# Altium schematic sheet 0072_HSIO MUXING -3.SchDoc
size 848 x 558 mm
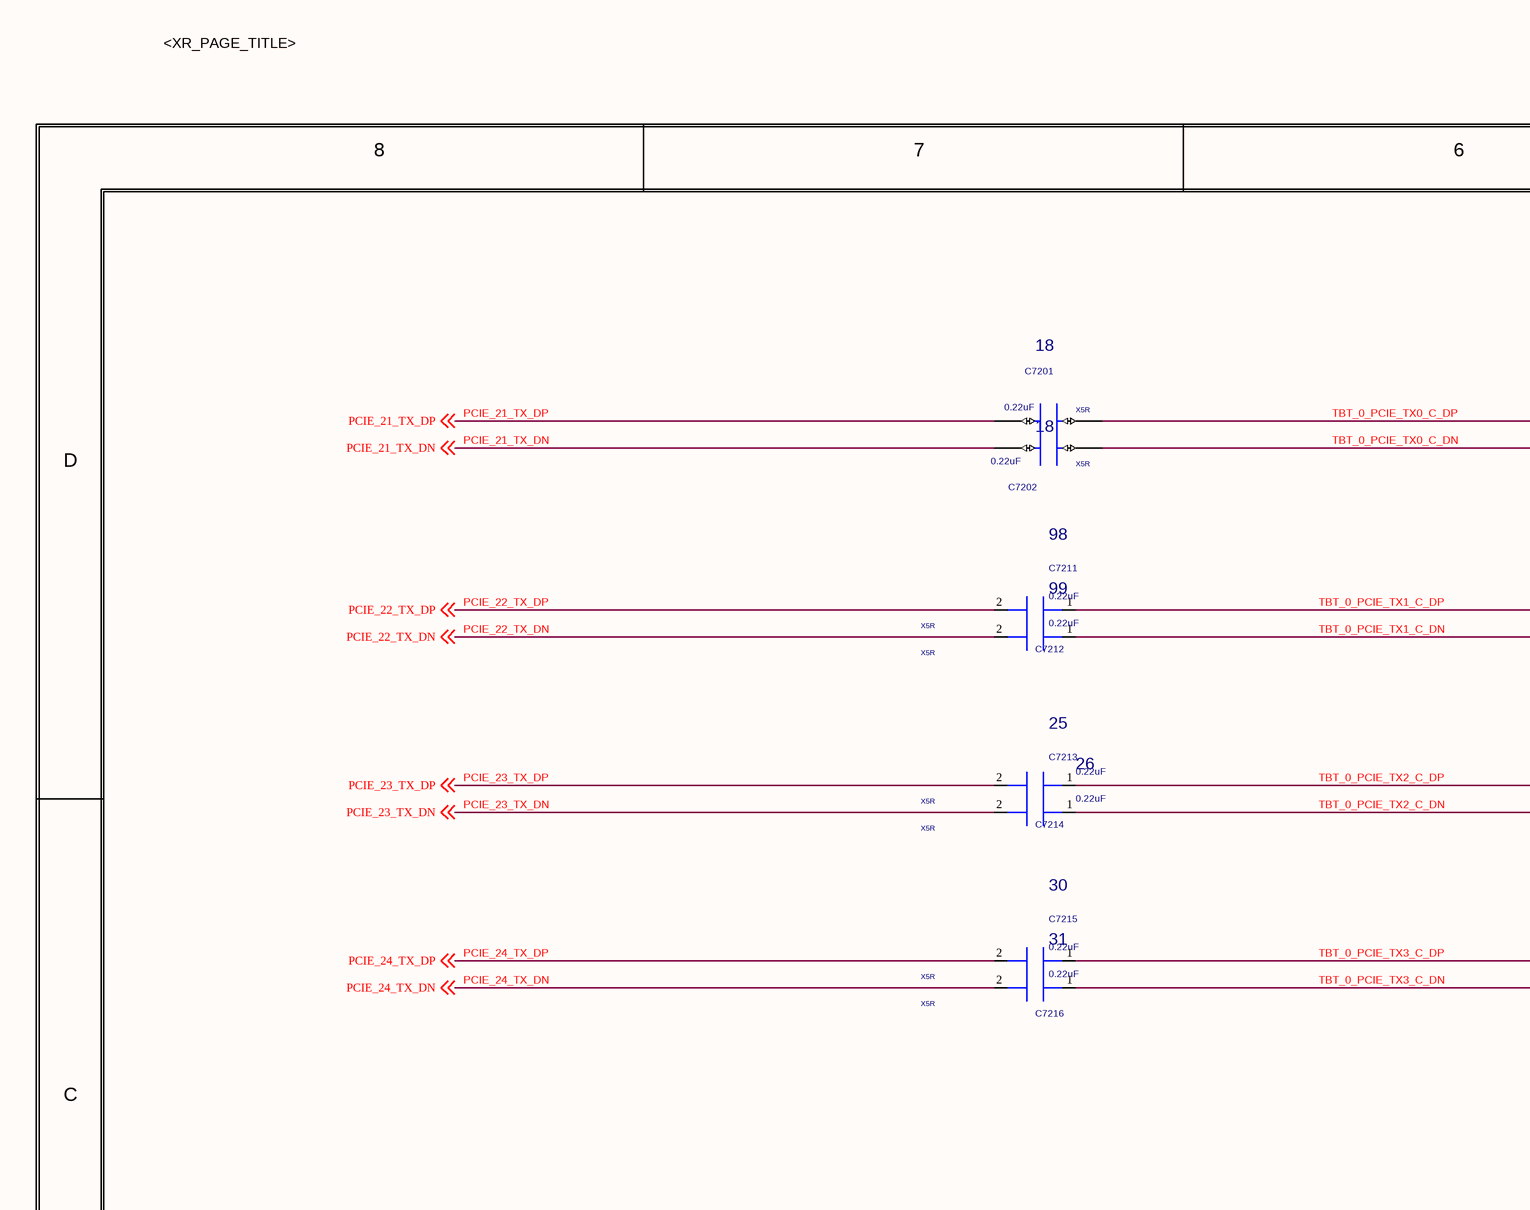
[diagram p0: 0072_HSIO MUXING -3.SchDoc, top left]
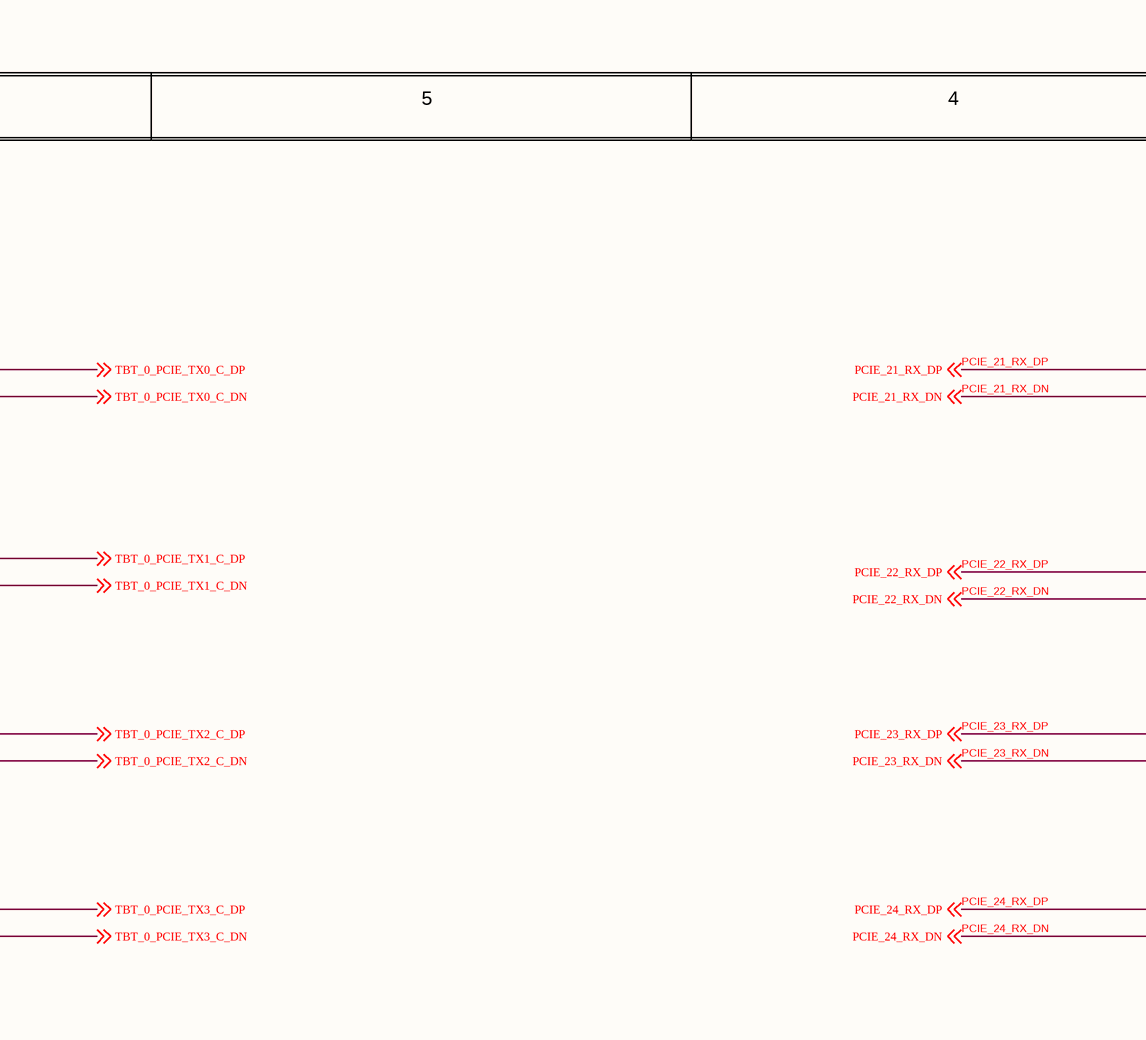
[diagram p1: 0072_HSIO MUXING -3.SchDoc, top middle]
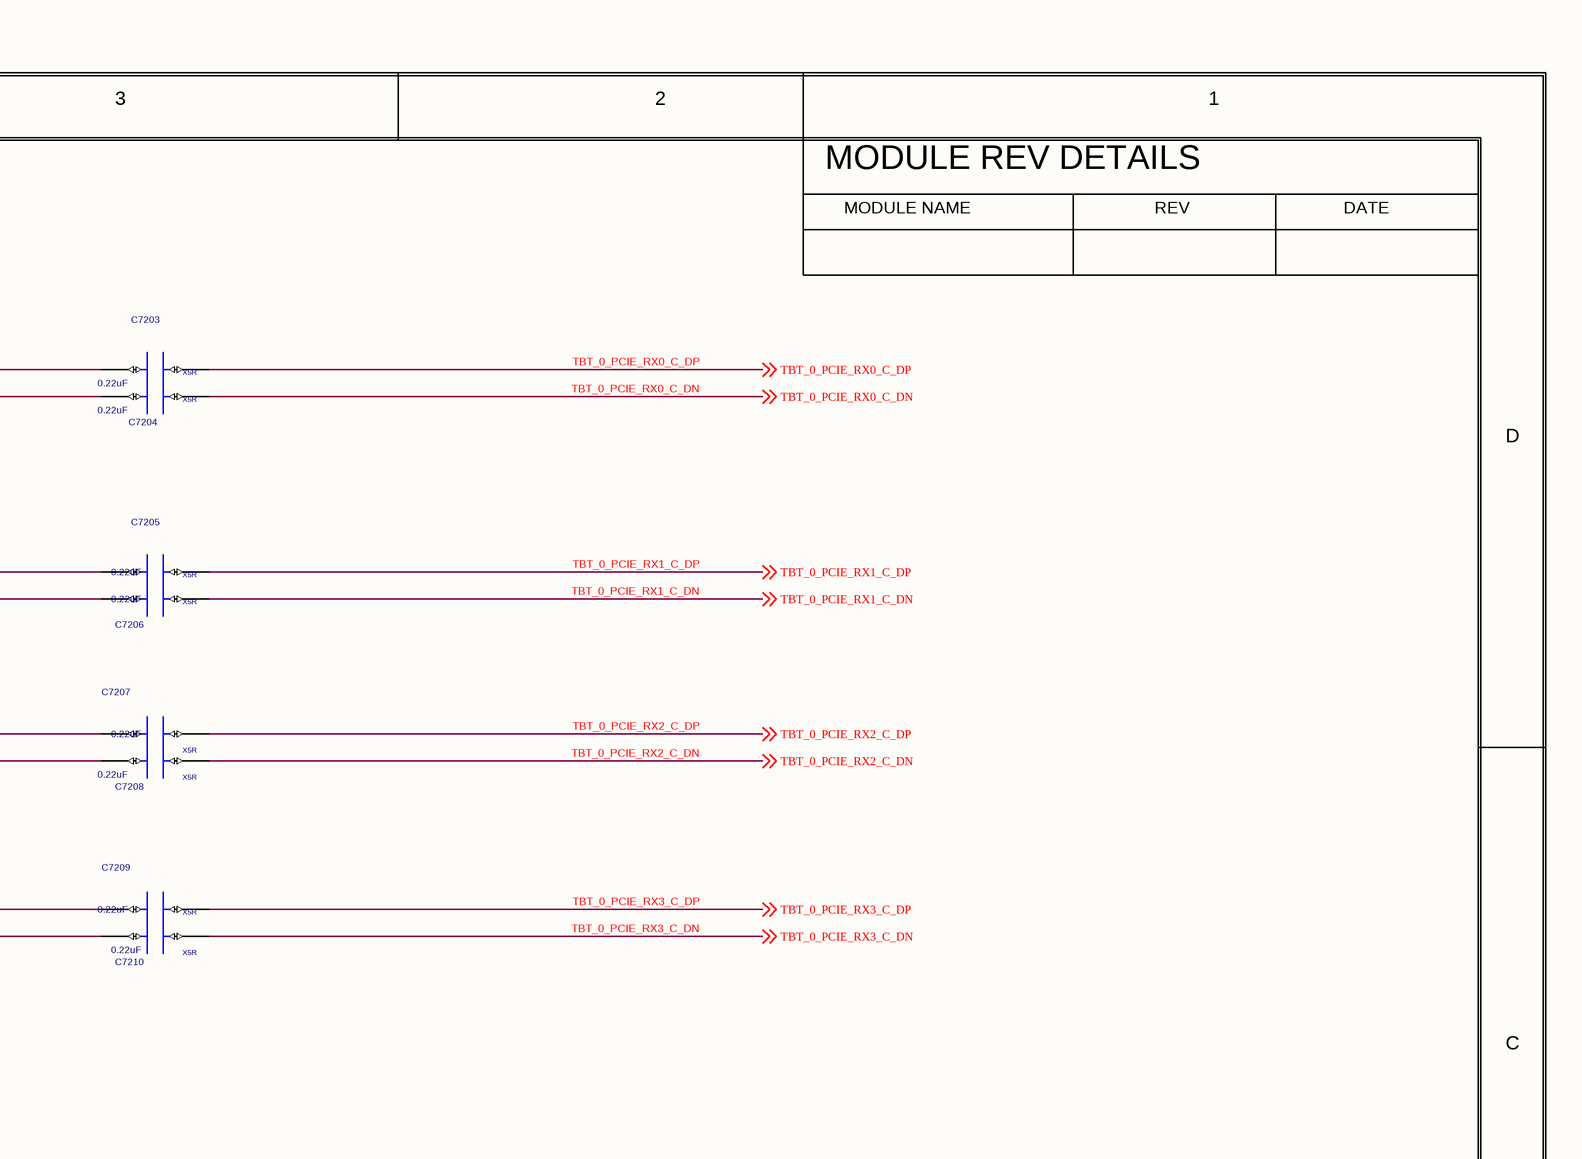
[diagram p2: 0072_HSIO MUXING -3.SchDoc, top right]
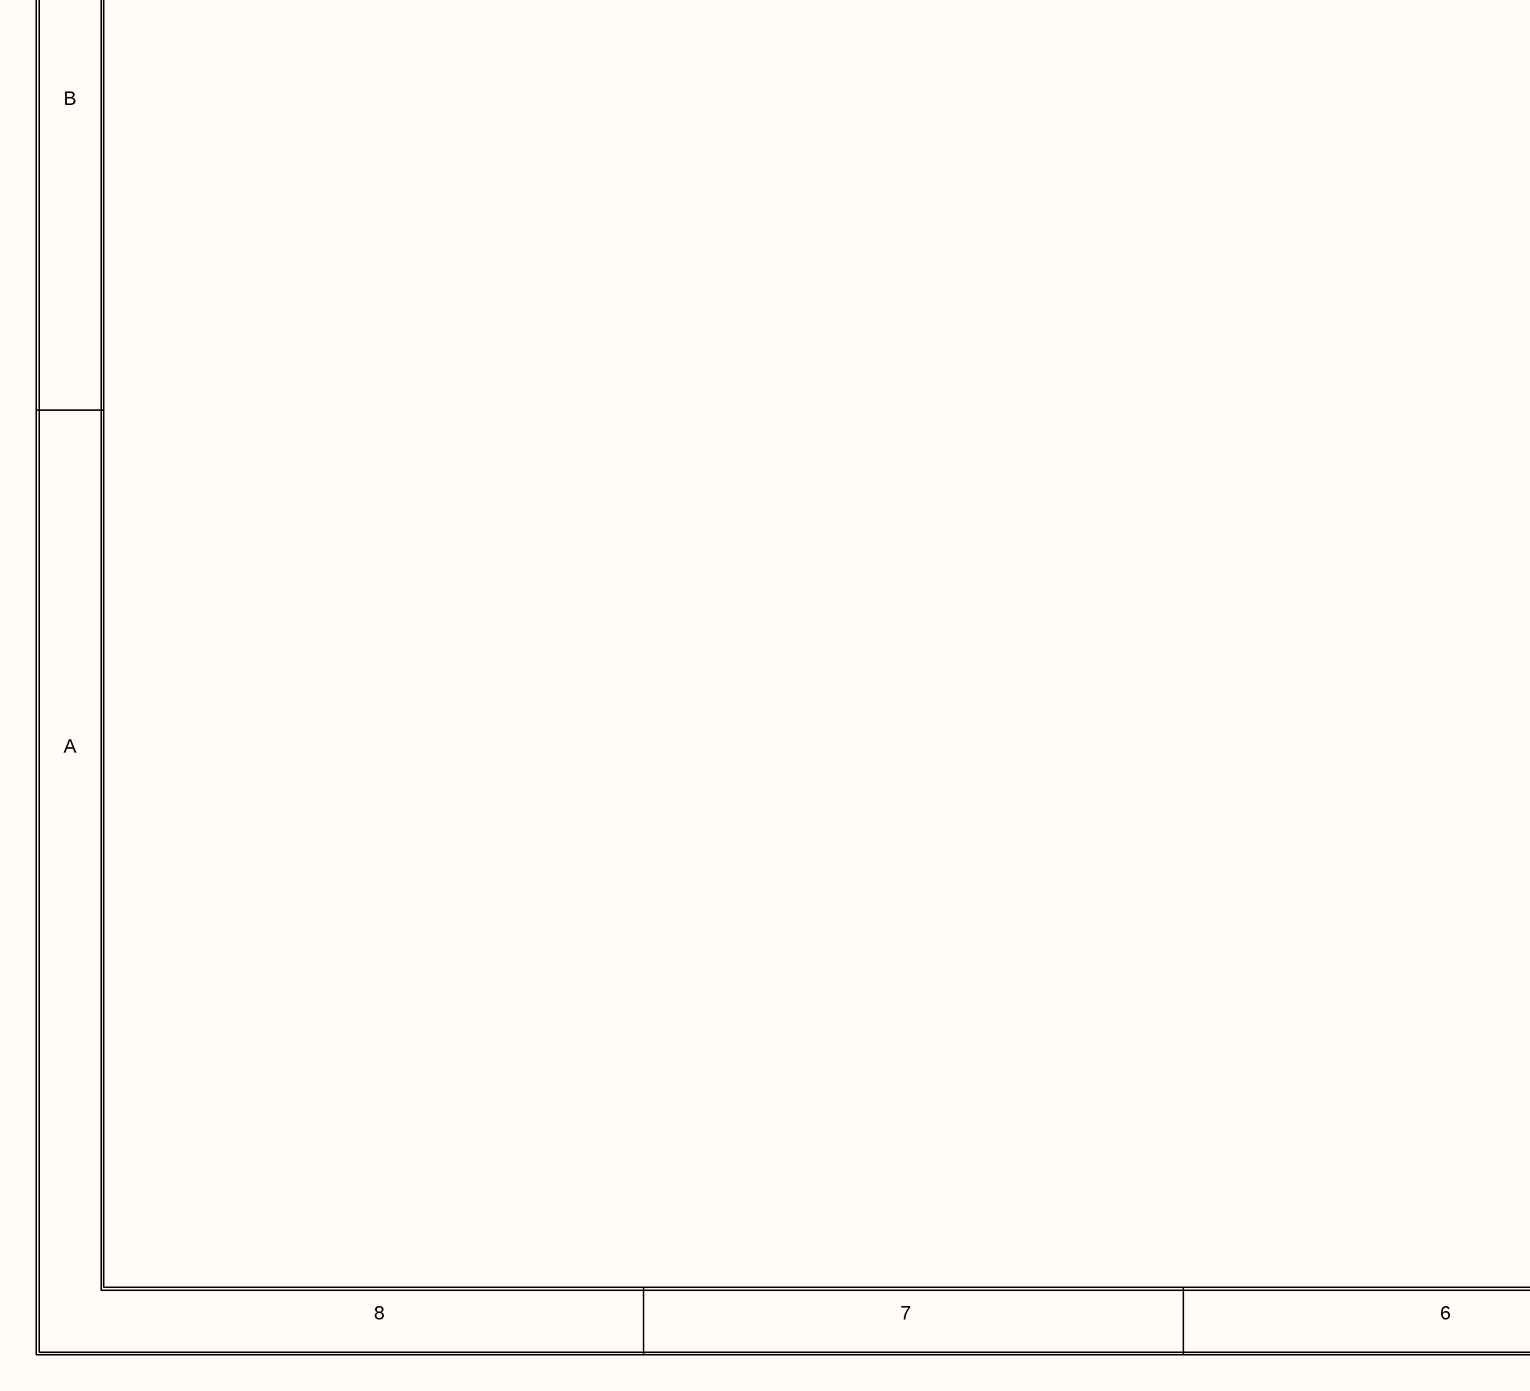
[diagram p3: 0072_HSIO MUXING -3.SchDoc, bottom left]
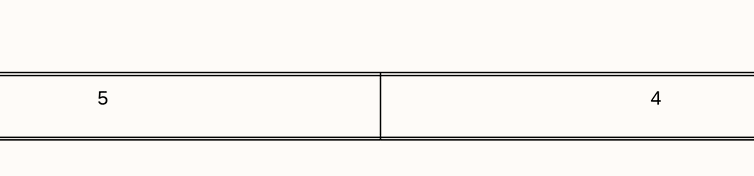
[diagram p4: 0072_HSIO MUXING -3.SchDoc, bottom middle]
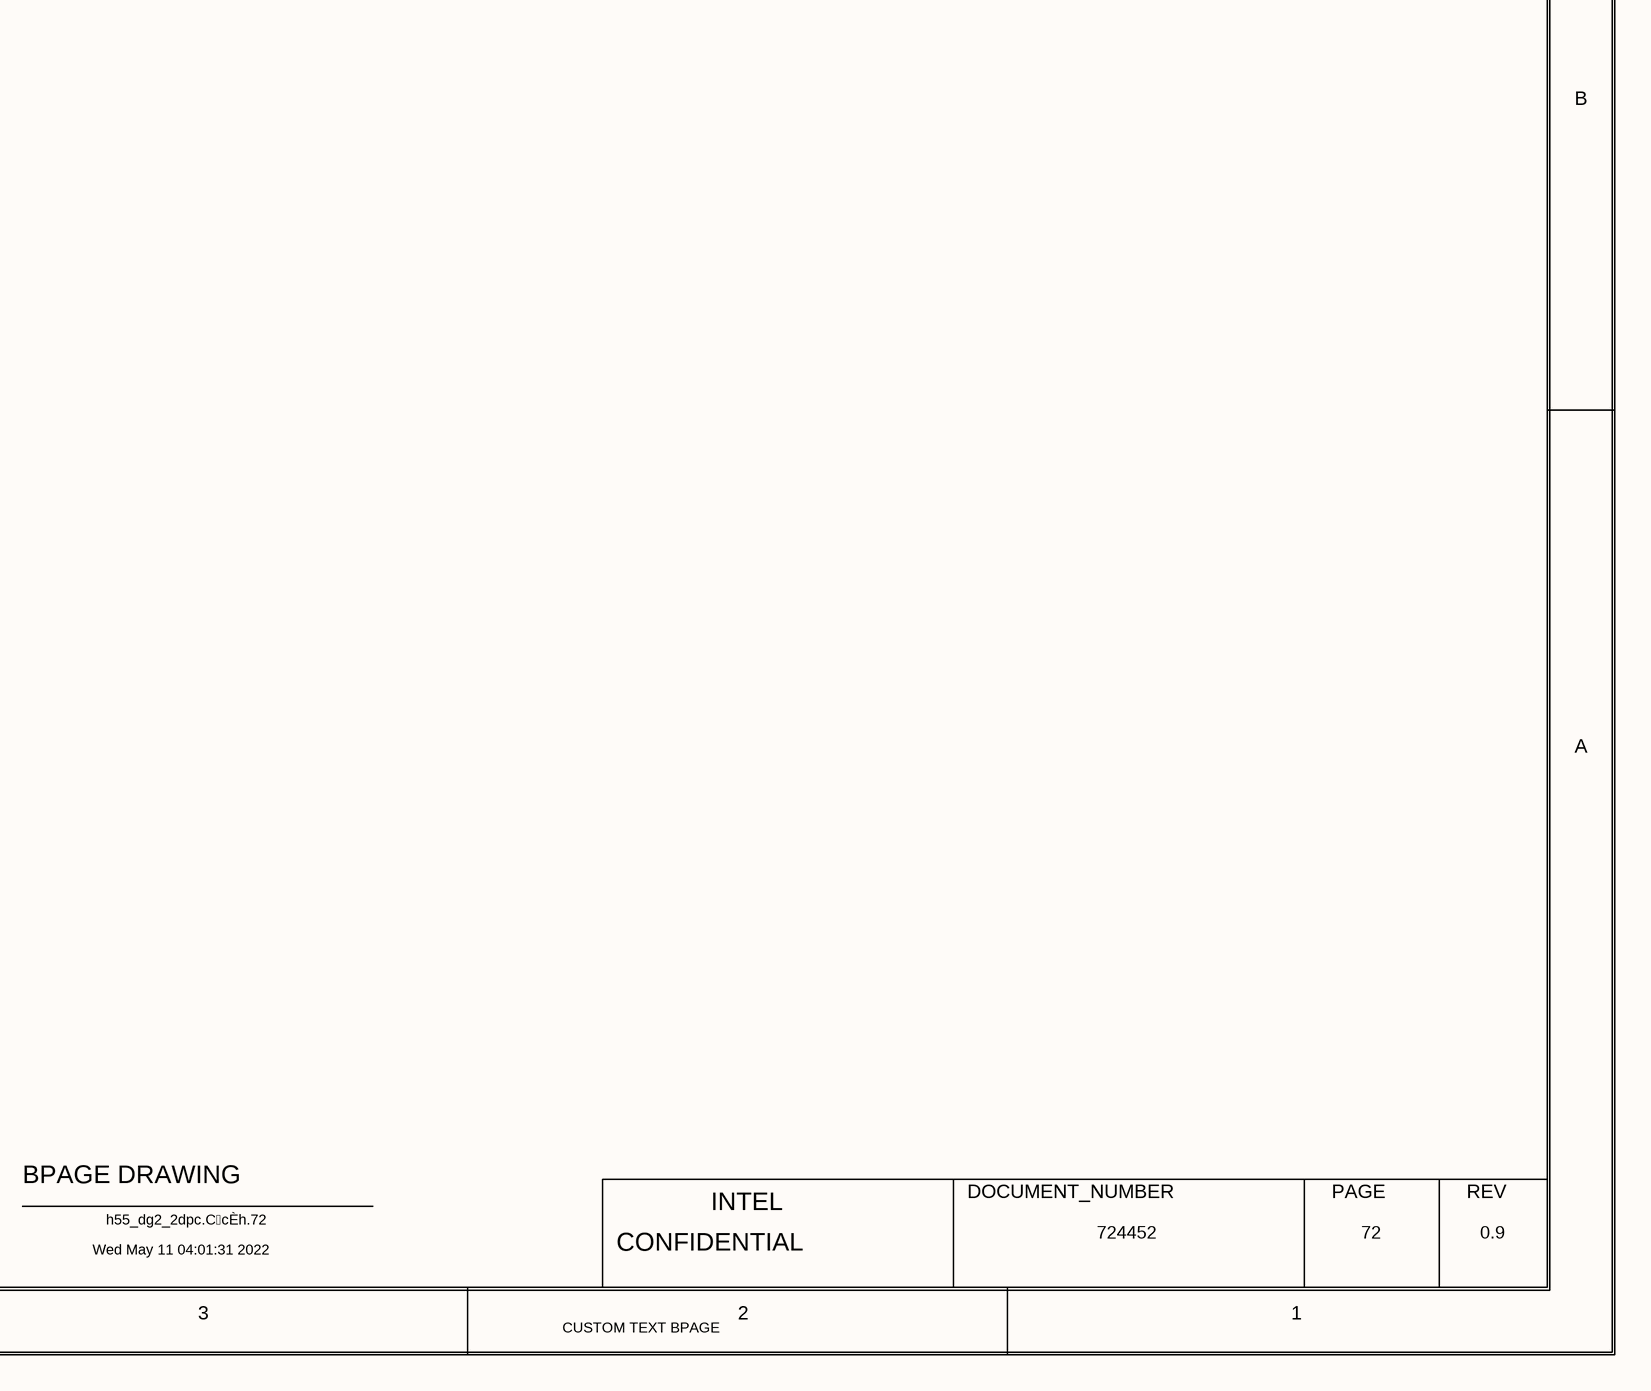
[diagram p5: 0072_HSIO MUXING -3.SchDoc, bottom right]

## Parts
C7201  0.22uF  MATERIAL: X5R  REUSE_ID: 18  [CTK0_SM0201_630X330_MA]
C7202  0.22uF  MATERIAL: X5R  REUSE_ID: 18  [CTK0_SM0201_630X330_MA]
C7203  0.22uF  MATERIAL: X5R  [CTK0_SM0201_630X330_MA]
C7204  0.22uF  MATERIAL: X5R  [CTK0_SM0201_630X330_MA]
C7205  0.22uF  MATERIAL: X5R  [CTK0_SM0201_630X330_MA]
C7206  0.22uF  MATERIAL: X5R  [CTK0_SM0201_630X330_MA]
C7207  0.22uF  MATERIAL: X5R  [CTK0_SM0201_630X330_MA]
C7208  0.22uF  MATERIAL: X5R  [CTK0_SM0201_630X330_MA]
C7209  0.22uF  MATERIAL: X5R  [CTK0_SM0201_630X330_MA]
C7210  0.22uF  MATERIAL: X5R  [CTK0_SM0201_630X330_MA]
C7211  0.22uF  MATERIAL: X5R  REUSE_ID: 98  [SMC0201MB]
C7212  0.22uF  MATERIAL: X5R  REUSE_ID: 99  [SMC0201MB]
C7213  0.22uF  MATERIAL: X5R  REUSE_ID: 25  [SMC0201MB]
C7214  0.22uF  MATERIAL: X5R  REUSE_ID: 26  [SMC0201MB]
C7215  0.22uF  MATERIAL: X5R  REUSE_ID: 30  [SMC0201MB]
C7216  0.22uF  MATERIAL: X5R  REUSE_ID: 31  [SMC0201MB]

## Nets
PCIE_21_RX_DN: C7204.1(A) ; off-sheet PCIE_21_RX_DN
PCIE_21_RX_DP: C7203.1(A) ; off-sheet PCIE_21_RX_DP
PCIE_21_TX_DN: C7202.1(A) ; off-sheet PCIE_21_TX_DN
PCIE_21_TX_DP: C7201.1(A) ; off-sheet PCIE_21_TX_DP
PCIE_22_RX_DN: C7206.1(A) ; off-sheet PCIE_22_RX_DN
PCIE_22_RX_DP: C7205.1(A) ; off-sheet PCIE_22_RX_DP
PCIE_22_TX_DN: C7212.2(B) ; off-sheet PCIE_22_TX_DN
PCIE_22_TX_DP: C7211.2(B) ; off-sheet PCIE_22_TX_DP
PCIE_23_RX_DN: C7208.1(A) ; off-sheet PCIE_23_RX_DN
PCIE_23_RX_DP: C7207.1(A) ; off-sheet PCIE_23_RX_DP
PCIE_23_TX_DN: C7214.2(B) ; off-sheet PCIE_23_TX_DN
PCIE_23_TX_DP: C7213.2(B) ; off-sheet PCIE_23_TX_DP
PCIE_24_RX_DN: C7210.1(A) ; off-sheet PCIE_24_RX_DN
PCIE_24_RX_DP: C7209.1(A) ; off-sheet PCIE_24_RX_DP
PCIE_24_TX_DN: C7216.2(B) ; off-sheet PCIE_24_TX_DN
PCIE_24_TX_DP: C7215.2(B) ; off-sheet PCIE_24_TX_DP
TBT_0_PCIE_RX0_C_DN: C7204.2(B) ; off-sheet TBT_0_PCIE_RX0_C_DN
TBT_0_PCIE_RX0_C_DP: C7203.2(B) ; off-sheet TBT_0_PCIE_RX0_C_DP
TBT_0_PCIE_RX1_C_DN: C7206.2(B) ; off-sheet TBT_0_PCIE_RX1_C_DN
TBT_0_PCIE_RX1_C_DP: C7205.2(B) ; off-sheet TBT_0_PCIE_RX1_C_DP
TBT_0_PCIE_RX2_C_DN: C7208.2(B) ; off-sheet TBT_0_PCIE_RX2_C_DN
TBT_0_PCIE_RX2_C_DP: C7207.2(B) ; off-sheet TBT_0_PCIE_RX2_C_DP
TBT_0_PCIE_RX3_C_DN: C7210.2(B) ; off-sheet TBT_0_PCIE_RX3_C_DN
TBT_0_PCIE_RX3_C_DP: C7209.2(B) ; off-sheet TBT_0_PCIE_RX3_C_DP
TBT_0_PCIE_TX0_C_DN: C7202.2(B) ; off-sheet TBT_0_PCIE_TX0_C_DN
TBT_0_PCIE_TX0_C_DP: C7201.2(B) ; off-sheet TBT_0_PCIE_TX0_C_DP
TBT_0_PCIE_TX1_C_DN: C7212.1(A) ; off-sheet TBT_0_PCIE_TX1_C_DN
TBT_0_PCIE_TX1_C_DP: C7211.1(A) ; off-sheet TBT_0_PCIE_TX1_C_DP
TBT_0_PCIE_TX2_C_DN: C7214.1(A) ; off-sheet TBT_0_PCIE_TX2_C_DN
TBT_0_PCIE_TX2_C_DP: C7213.1(A) ; off-sheet TBT_0_PCIE_TX2_C_DP
TBT_0_PCIE_TX3_C_DN: C7216.1(A) ; off-sheet TBT_0_PCIE_TX3_C_DN
TBT_0_PCIE_TX3_C_DP: C7215.1(A) ; off-sheet TBT_0_PCIE_TX3_C_DP

## Notes on the sheet
- <XR_PAGE_TITLE>
- 8
- 7
- 6
- 5
- 4
- 3
- 2
- 1
- MODULE REV DETAILS
- MODULE NAME
- REV
- DATE
- D
- C
- B
- A
- BPAGE DRAWING
- INTEL
- DOCUMENT_NUMBER
- PAGE
- Wed May 11 04:01:31 2022
- h55_dg2_2dpc.CcÈh.72
- CONFIDENTIAL
- 724452
- 72
- 0.9
- CUSTOM TEXT BPAGE

## Library data of the parts
C7201 = C_CAP#1: PART_NUMBER: K27071-001; CHIPS_PART_NAME: C_CAP; CDS_PHYS_PART_NAME: C_CAP_0201-K27071-001,X5R,0.22UF,25V,20%,TK0,GENERIC; CDS_LMAN_SYM_OUTLINE: -50,50,50,-50; FP_TECH: TK0; IP: GENERIC; PACK_TYPE: 0201; ROOM: NONE; TOLERANCE: 20%; VOLTAGE: 25V; OriginalSymbolOrigin: (-25,50); XY: (-8300,4950); VER: 2; ROT: 0; PHYS_PAGE: 72; LOCATION: C7201; DRAWING: @RVP1_ADL_SB_ADP_S_DDR5_SODIMM_2DPC_LIB.H55_DG2_2DPC(SCH_1):PAGE72; CDS_LIB: c_discrete; VARIANT: ?; PCB Footprint: CTK0_SM0201_630X330_MA; CDS_PART_NAME: C_CAP_0201-K27071-001,X5R,0.22UF,25V,20%,TK0,GENERIC; CDS_LOCATION: C7201
C7202 = C_CAP#1: PART_NUMBER: K27071-001; CHIPS_PART_NAME: C_CAP; CDS_PHYS_PART_NAME: C_CAP_0201-K27071-001,X5R,0.22UF,25V,20%,TK0,GENERIC; CDS_LMAN_SYM_OUTLINE: -50,50,50,-50; FP_TECH: TK0; IP: GENERIC; PACK_TYPE: 0201; ROOM: NONE; TOLERANCE: 20%; VOLTAGE: 25V; OriginalSymbolOrigin: (-25,50); XY: (-8300,4900); VER: 2; ROT: 0; PHYS_PAGE: 72; LOCATION: C7202; DRAWING: @RVP1_ADL_SB_ADP_S_DDR5_SODIMM_2DPC_LIB.H55_DG2_2DPC(SCH_1):PAGE72; CDS_LIB: c_discrete; VARIANT: ?; PCB Footprint: CTK0_SM0201_630X330_MA; CDS_PART_NAME: C_CAP_0201-K27071-001,X5R,0.22UF,25V,20%,TK0,GENERIC; CDS_LOCATION: C7202
C7203 = C_CAP#1: PART_NUMBER: K27071-001; CHIPS_PART_NAME: C_CAP; CDS_PHYS_PART_NAME: C_CAP_0201-K27071-001,X5R,0.22UF,25V,20%,TK0,GENERIC; CDS_LMAN_SYM_OUTLINE: -50,50,50,-50; FP_TECH: TK0; IP: GENERIC; PACK_TYPE: 0201; ROOM: NONE; TOLERANCE: 20%; VOLTAGE: 25V; OriginalSymbolOrigin: (-25,50); XY: (-4500,4950); VER: 2; ROT: 0; PHYS_PAGE: 72; LOCATION: C7203; DRAWING: @RVP1_ADL_SB_ADP_S_DDR5_SODIMM_2DPC_LIB.H55_DG2_2DPC(SCH_1):PAGE72; CDS_LIB: c_discrete; VARIANT: ?; PCB Footprint: CTK0_SM0201_630X330_MA; CDS_PART_NAME: C_CAP_0201-K27071-001,X5R,0.22UF,25V,20%,TK0,GENERIC; CDS_LOCATION: C7203
C7204 = C_CAP#1: PART_NUMBER: K27071-001; CHIPS_PART_NAME: C_CAP; CDS_PHYS_PART_NAME: C_CAP_0201-K27071-001,X5R,0.22UF,25V,20%,TK0,GENERIC; CDS_LMAN_SYM_OUTLINE: -50,50,50,-50; FP_TECH: TK0; IP: GENERIC; PACK_TYPE: 0201; ROOM: NONE; TOLERANCE: 20%; VOLTAGE: 25V; OriginalSymbolOrigin: (-25,50); XY: (-4500,4900); VER: 2; ROT: 0; PHYS_PAGE: 72; LOCATION: C7204; DRAWING: @RVP1_ADL_SB_ADP_S_DDR5_SODIMM_2DPC_LIB.H55_DG2_2DPC(SCH_1):PAGE72; CDS_LIB: c_discrete; VARIANT: ?; PCB Footprint: CTK0_SM0201_630X330_MA; CDS_PART_NAME: C_CAP_0201-K27071-001,X5R,0.22UF,25V,20%,TK0,GENERIC; CDS_LOCATION: C7204
C7205 = C_CAP#1: PART_NUMBER: K27071-001; CHIPS_PART_NAME: C_CAP; CDS_PHYS_PART_NAME: C_CAP_0201-K27071-001,X5R,0.22UF,25V,20%,TK0,GENERIC; CDS_LMAN_SYM_OUTLINE: -50,50,50,-50; FP_TECH: TK0; IP: GENERIC; PACK_TYPE: 0201; ROOM: NONE; TOLERANCE: 20%; VOLTAGE: 25V; OriginalSymbolOrigin: (-25,50); XY: (-4500,4575); VER: 2; ROT: 0; PHYS_PAGE: 72; LOCATION: C7205; DRAWING: @RVP1_ADL_SB_ADP_S_DDR5_SODIMM_2DPC_LIB.H55_DG2_2DPC(SCH_1):PAGE72; CDS_LIB: c_discrete; VARIANT: ?; PCB Footprint: CTK0_SM0201_630X330_MA; CDS_PART_NAME: C_CAP_0201-K27071-001,X5R,0.22UF,25V,20%,TK0,GENERIC; CDS_LOCATION: C7205
C7206 = C_CAP#1: PART_NUMBER: K27071-001; CHIPS_PART_NAME: C_CAP; CDS_PHYS_PART_NAME: C_CAP_0201-K27071-001,X5R,0.22UF,25V,20%,TK0,GENERIC; CDS_LMAN_SYM_OUTLINE: -50,50,50,-50; FP_TECH: TK0; IP: GENERIC; PACK_TYPE: 0201; ROOM: NONE; TOLERANCE: 20%; VOLTAGE: 25V; OriginalSymbolOrigin: (-25,50); XY: (-4500,4525); VER: 2; ROT: 0; PHYS_PAGE: 72; LOCATION: C7206; DRAWING: @RVP1_ADL_SB_ADP_S_DDR5_SODIMM_2DPC_LIB.H55_DG2_2DPC(SCH_1):PAGE72; CDS_LIB: c_discrete; VARIANT: ?; PCB Footprint: CTK0_SM0201_630X330_MA; CDS_PART_NAME: C_CAP_0201-K27071-001,X5R,0.22UF,25V,20%,TK0,GENERIC; CDS_LOCATION: C7206
C7207 = C_CAP#1: PART_NUMBER: K27071-001; CHIPS_PART_NAME: C_CAP; CDS_PHYS_PART_NAME: C_CAP_0201-K27071-001,X5R,0.22UF,25V,20%,TK0,GENERIC; CDS_LMAN_SYM_OUTLINE: -50,50,50,-50; FP_TECH: TK0; IP: GENERIC; PACK_TYPE: 0201; ROOM: NONE; TOLERANCE: 20%; VOLTAGE: 25V; OriginalSymbolOrigin: (-25,50); XY: (-4500,4275); VER: 2; ROT: 0; PHYS_PAGE: 72; LOCATION: C7207; DRAWING: @RVP1_ADL_SB_ADP_S_DDR5_SODIMM_2DPC_LIB.H55_DG2_2DPC(SCH_1):PAGE72; CDS_LIB: c_discrete; VARIANT: ?; PCB Footprint: CTK0_SM0201_630X330_MA; CDS_PART_NAME: C_CAP_0201-K27071-001,X5R,0.22UF,25V,20%,TK0,GENERIC; CDS_LOCATION: C7207
C7208 = C_CAP#1: PART_NUMBER: K27071-001; CHIPS_PART_NAME: C_CAP; CDS_PHYS_PART_NAME: C_CAP_0201-K27071-001,X5R,0.22UF,25V,20%,TK0,GENERIC; CDS_LMAN_SYM_OUTLINE: -50,50,50,-50; FP_TECH: TK0; IP: GENERIC; PACK_TYPE: 0201; ROOM: NONE; TOLERANCE: 20%; VOLTAGE: 25V; OriginalSymbolOrigin: (-25,50); XY: (-4500,4225); VER: 2; ROT: 0; PHYS_PAGE: 72; LOCATION: C7208; DRAWING: @RVP1_ADL_SB_ADP_S_DDR5_SODIMM_2DPC_LIB.H55_DG2_2DPC(SCH_1):PAGE72; CDS_LIB: c_discrete; VARIANT: ?; PCB Footprint: CTK0_SM0201_630X330_MA; CDS_PART_NAME: C_CAP_0201-K27071-001,X5R,0.22UF,25V,20%,TK0,GENERIC; CDS_LOCATION: C7208
C7209 = C_CAP#1: PART_NUMBER: K27071-001; CHIPS_PART_NAME: C_CAP; CDS_PHYS_PART_NAME: C_CAP_0201-K27071-001,X5R,0.22UF,25V,20%,TK0,GENERIC; CDS_LMAN_SYM_OUTLINE: -50,50,50,-50; FP_TECH: TK0; IP: GENERIC; PACK_TYPE: 0201; ROOM: NONE; TOLERANCE: 20%; VOLTAGE: 25V; OriginalSymbolOrigin: (-25,50); XY: (-4500,3950); VER: 2; ROT: 0; PHYS_PAGE: 72; LOCATION: C7209; DRAWING: @RVP1_ADL_SB_ADP_S_DDR5_SODIMM_2DPC_LIB.H55_DG2_2DPC(SCH_1):PAGE72; CDS_LIB: c_discrete; VARIANT: ?; PCB Footprint: CTK0_SM0201_630X330_MA; CDS_PART_NAME: C_CAP_0201-K27071-001,X5R,0.22UF,25V,20%,TK0,GENERIC; CDS_LOCATION: C7209
C7210 = C_CAP#1: PART_NUMBER: K27071-001; CHIPS_PART_NAME: C_CAP; CDS_PHYS_PART_NAME: C_CAP_0201-K27071-001,X5R,0.22UF,25V,20%,TK0,GENERIC; CDS_LMAN_SYM_OUTLINE: -50,50,50,-50; FP_TECH: TK0; IP: GENERIC; PACK_TYPE: 0201; ROOM: NONE; TOLERANCE: 20%; VOLTAGE: 25V; OriginalSymbolOrigin: (-25,50); XY: (-4500,3900); VER: 2; ROT: 0; PHYS_PAGE: 72; LOCATION: C7210; DRAWING: @RVP1_ADL_SB_ADP_S_DDR5_SODIMM_2DPC_LIB.H55_DG2_2DPC(SCH_1):PAGE72; CDS_LIB: c_discrete; VARIANT: ?; PCB Footprint: CTK0_SM0201_630X330_MA; CDS_PART_NAME: C_CAP_0201-K27071-001,X5R,0.22UF,25V,20%,TK0,GENERIC; CDS_LOCATION: C7210
C7211 = CAP#2: PART_NUMBER: K27071-001; CHIPS_PART_NAME: CAP; CDS_PHYS_PART_NAME: CAP_0201-K27071-001,X5R,0.22UF,25V,20%,LPDB,GENERIC; PACK_TYPE: 0201; TOLERANCE: 20%; VOLTAGE: 25V; OriginalSymbolOrigin: (-75,25); XY: (-8350,4600); VER: 4; ROT: 2; PHYS_PAGE: 72; LOCATION: C7211; IP: GENERIC; FP_TECH: LPDB; DRAWING: @RVP1_ADL_SB_ADP_S_DDR5_SODIMM_2DPC_LIB.H55_DG2_2DPC(SCH_1):PAGE72; CDS_LIB: discrete; PCB Footprint: SMC0201MB; CDS_PART_NAME: CAP_0201-K27071-001,X5R,0.22UF,25V,20%,LPDB,GENERIC; CDS_LOCATION: C7211; ASI_MODEL: K27071-001
C7212 = CAP#2: PART_NUMBER: K27071-001; CHIPS_PART_NAME: CAP; CDS_PHYS_PART_NAME: CAP_0201-K27071-001,X5R,0.22UF,25V,20%,LPDB,GENERIC; PACK_TYPE: 0201; TOLERANCE: 20%; VOLTAGE: 25V; OriginalSymbolOrigin: (-75,25); XY: (-8350,4550); VER: 4; ROT: 2; PHYS_PAGE: 72; LOCATION: C7212; IP: GENERIC; FP_TECH: LPDB; DRAWING: @RVP1_ADL_SB_ADP_S_DDR5_SODIMM_2DPC_LIB.H55_DG2_2DPC(SCH_1):PAGE72; CDS_LIB: discrete; PCB Footprint: SMC0201MB; CDS_PART_NAME: CAP_0201-K27071-001,X5R,0.22UF,25V,20%,LPDB,GENERIC; CDS_LOCATION: C7212; ASI_MODEL: K27071-001
C7213 = CAP#2: PART_NUMBER: K27071-001; CHIPS_PART_NAME: CAP; CDS_PHYS_PART_NAME: CAP_0201-K27071-001,X5R,0.22UF,25V,20%,LPDB,GENERIC; PACK_TYPE: 0201; TOLERANCE: 20%; VOLTAGE: 25V; OriginalSymbolOrigin: (-75,25); XY: (-8350,4275); VER: 4; ROT: 2; PHYS_PAGE: 72; LOCATION: C7213; IP: GENERIC; FP_TECH: LPDB; DRAWING: @RVP1_ADL_SB_ADP_S_DDR5_SODIMM_2DPC_LIB.H55_DG2_2DPC(SCH_1):PAGE72; CDS_LIB: discrete; PCB Footprint: SMC0201MB; CDS_PART_NAME: CAP_0201-K27071-001,X5R,0.22UF,25V,20%,LPDB,GENERIC; CDS_LOCATION: C7213; ASI_MODEL: K27071-001
C7214 = CAP#2: PART_NUMBER: K27071-001; CHIPS_PART_NAME: CAP; CDS_PHYS_PART_NAME: CAP_0201-K27071-001,X5R,0.22UF,25V,20%,LPDB,GENERIC; PACK_TYPE: 0201; TOLERANCE: 20%; VOLTAGE: 25V; OriginalSymbolOrigin: (-75,25); XY: (-8350,4225); VER: 4; ROT: 2; PHYS_PAGE: 72; LOCATION: C7214; IP: GENERIC; FP_TECH: LPDB; DRAWING: @RVP1_ADL_SB_ADP_S_DDR5_SODIMM_2DPC_LIB.H55_DG2_2DPC(SCH_1):PAGE72; CDS_LIB: discrete; PCB Footprint: SMC0201MB; CDS_PART_NAME: CAP_0201-K27071-001,X5R,0.22UF,25V,20%,LPDB,GENERIC; CDS_LOCATION: C7214; ASI_MODEL: K27071-001
C7215 = CAP#2: PART_NUMBER: K27071-001; CHIPS_PART_NAME: CAP; CDS_PHYS_PART_NAME: CAP_0201-K27071-001,X5R,0.22UF,25V,20%,LPDB,GENERIC; PACK_TYPE: 0201; TOLERANCE: 20%; VOLTAGE: 25V; OriginalSymbolOrigin: (-75,25); XY: (-8350,3950); VER: 4; ROT: 2; PHYS_PAGE: 72; LOCATION: C7215; IP: GENERIC; FP_TECH: LPDB; DRAWING: @RVP1_ADL_SB_ADP_S_DDR5_SODIMM_2DPC_LIB.H55_DG2_2DPC(SCH_1):PAGE72; CDS_LIB: discrete; PCB Footprint: SMC0201MB; CDS_PART_NAME: CAP_0201-K27071-001,X5R,0.22UF,25V,20%,LPDB,GENERIC; CDS_LOCATION: C7215; ASI_MODEL: K27071-001
C7216 = CAP#2: PART_NUMBER: K27071-001; CHIPS_PART_NAME: CAP; CDS_PHYS_PART_NAME: CAP_0201-K27071-001,X5R,0.22UF,25V,20%,LPDB,GENERIC; PACK_TYPE: 0201; TOLERANCE: 20%; VOLTAGE: 25V; OriginalSymbolOrigin: (-75,25); XY: (-8350,3900); VER: 4; ROT: 2; PHYS_PAGE: 72; LOCATION: C7216; IP: GENERIC; FP_TECH: LPDB; DRAWING: @RVP1_ADL_SB_ADP_S_DDR5_SODIMM_2DPC_LIB.H55_DG2_2DPC(SCH_1):PAGE72; CDS_LIB: discrete; PCB Footprint: SMC0201MB; CDS_PART_NAME: CAP_0201-K27071-001,X5R,0.22UF,25V,20%,LPDB,GENERIC; CDS_LOCATION: C7216; ASI_MODEL: K27071-001